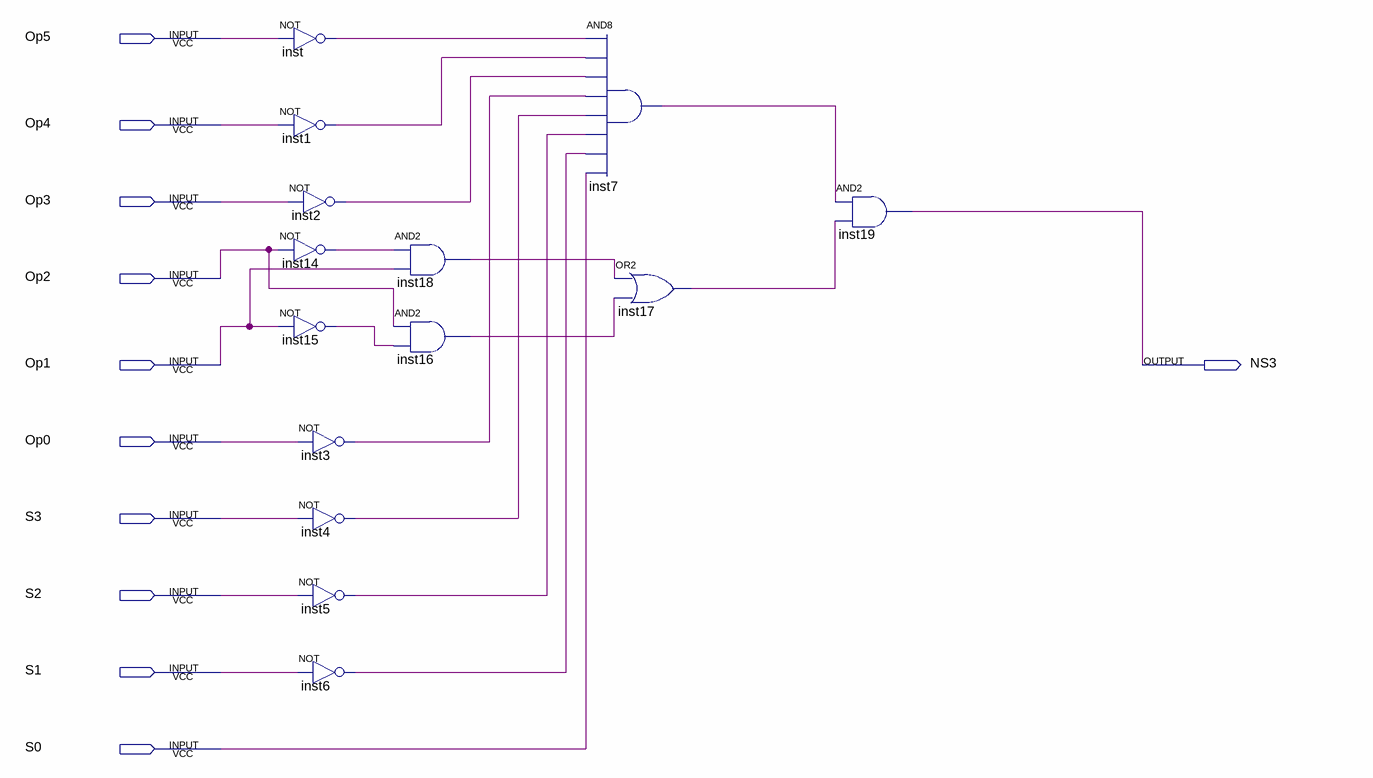
[diagram p0: schematic sheet]
// Quartus schematic NS3.bdf as structural Verilog: 14 symbols, 11 pins
module NS3 (
  input  Op5,
  input  Op4,
  input  Op3,
  input  Op2,
  input  Op1,
  input  Op0,
  input  S3,
  input  S2,
  input  S1,
  input  S0,
  output NS3
);

  wire inst1_out, inst2_out, inst3_out, inst4_out, inst5_out, inst6_out, inst7_out, inst14_out, inst15_out,
       inst16_out, inst17_out, inst18_out, inst_out;

  not inst (inst_out, Op5);
  not inst1 (inst1_out, Op4);
  not inst2 (inst2_out, Op3);
  not inst14 (inst14_out, Op2);
  not inst15 (inst15_out, Op1);
  not inst3 (inst3_out, Op0);
  not inst4 (inst4_out, S3);
  not inst5 (inst5_out, S2);
  not inst6 (inst6_out, S1);
  and inst18 (inst18_out, inst14_out, Op1);
  and inst16 (inst16_out, Op2, inst15_out);
  and inst7 (inst7_out, inst_out, inst1_out, inst2_out, inst3_out, inst4_out, inst5_out, inst6_out, S0);
  or inst17 (inst17_out, inst18_out, inst16_out);
  and inst19 (NS3, inst7_out, inst17_out);
endmodule
